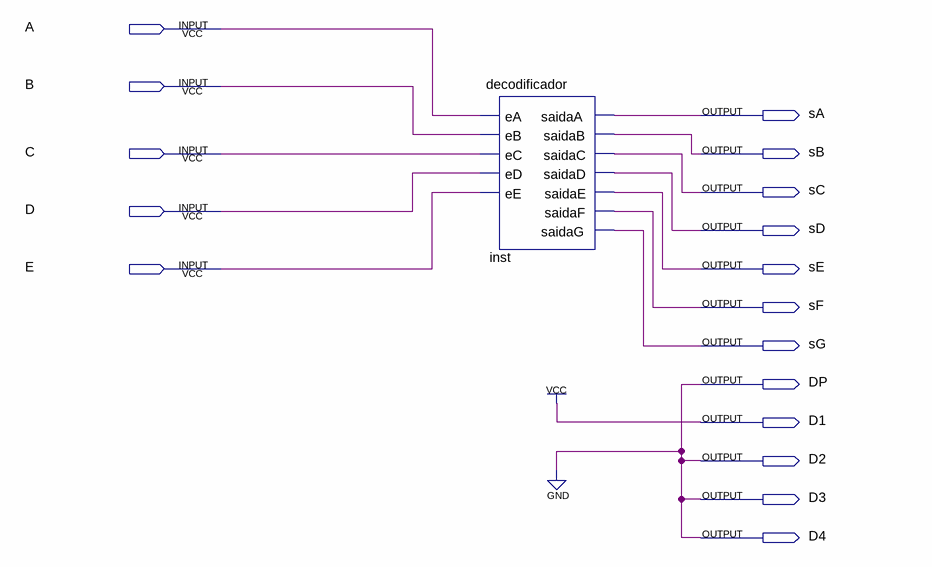
[diagram p0: schematic sheet]
// Quartus schematic Siekoo_Alphabet.bdf as structural Verilog: 1 symbols, 17 pins
module Siekoo_Alphabet (
  input  A,
  input  B,
  input  C,
  input  D,
  input  E,
  output sA,
  output sB,
  output sC,
  output sD,
  output sE,
  output sF,
  output sG,
  output DP,
  output D1,
  output D2,
  output D3,
  output D4
);

  decodificador inst (
    .eA(A), .eB(B), .eC(C), .eD(D), .eE(E), .saidaA(sA), .saidaB(sB), .saidaC(sC), .saidaD(sD), .saidaE(sE),
    .saidaF(sF), .saidaG(sG));

  assign D1 = 1'b1;
  assign D2 = 1'b0;
  assign D3 = 1'b0;
  assign D4 = 1'b0;
  assign DP = 1'b0;
endmodule
